# Altium project ASSIGNMENT_1.PrjPcb
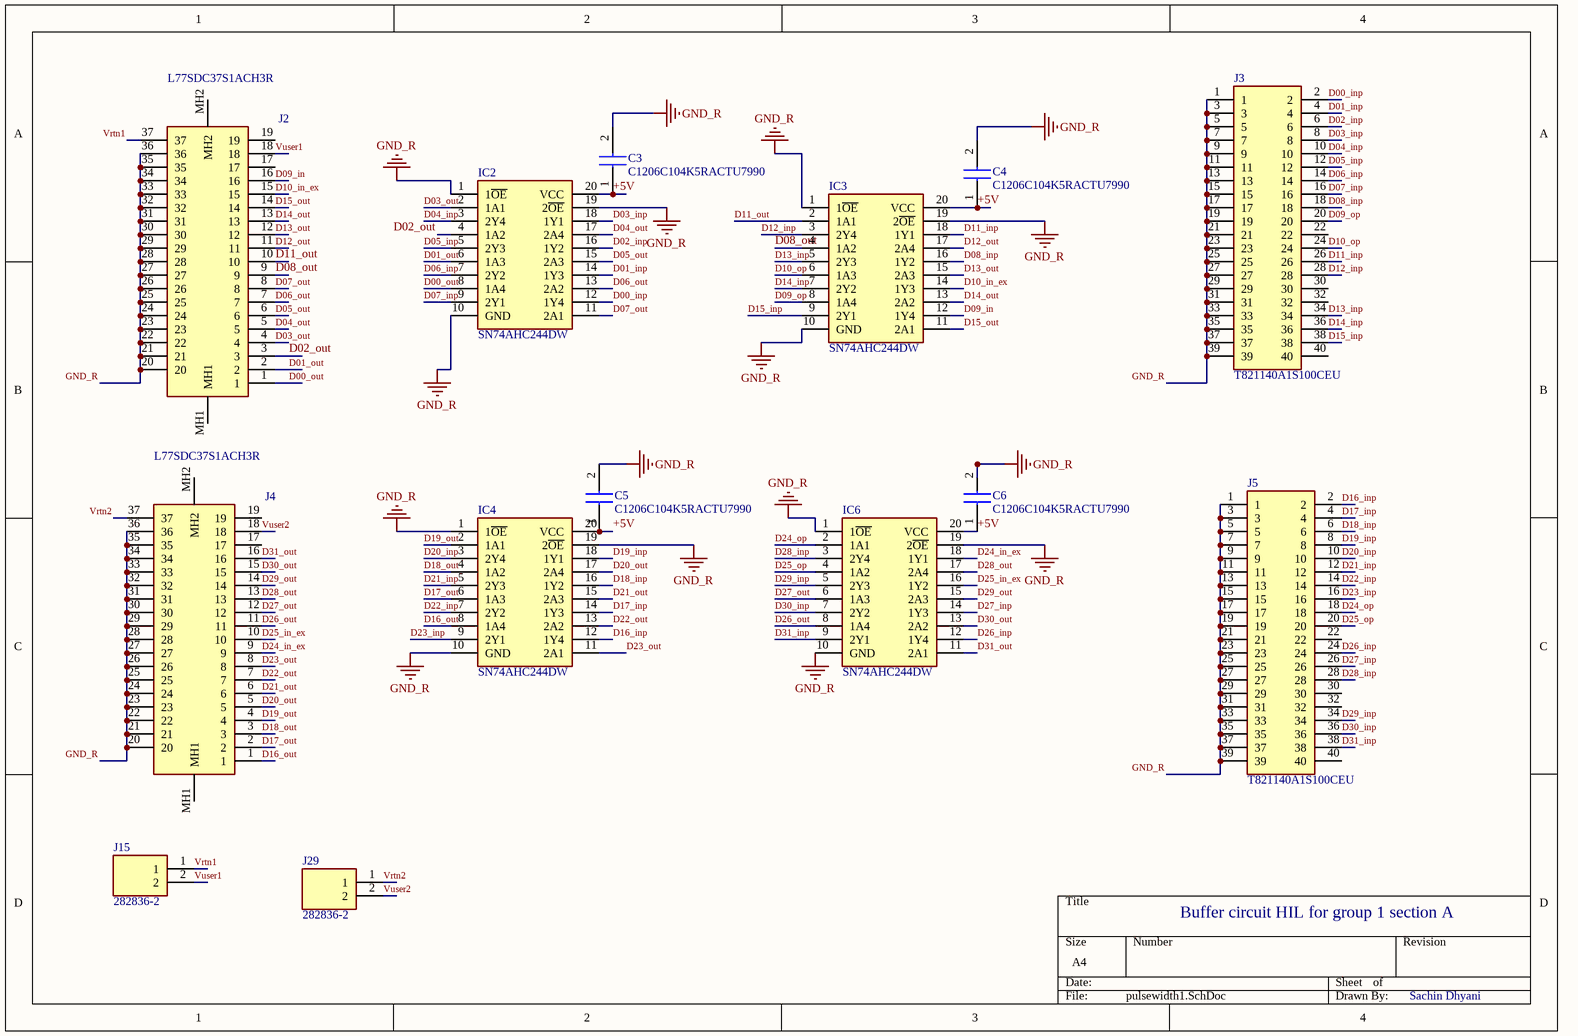
[diagram p0: pulsewidth1.SchDoc]
4 sheets, 53 parts. Net scope: global (net labels, ports and power ports of the same name join across sheets).
Board file: finalpcb.PcbDoc
Sheets:
  pulsewidth1.SchDoc
  pulsewidth2.SchDoc
  power_supply.SchDoc
  Analog_1_16.SchDoc

## Sheet pulsewidth1.SchDoc
size A4; SheetNumber: 1; SheetTotal: 4

### Parts
C3  C1206C104K5RACTU7990  [CAPC3216X88N]
C4  C1206C104K5RACTU7990  [CAPC3216X88N]
C5  C1206C104K5RACTU7990  [CAPC3216X88N]
C6  C1206C104K5RACTU7990  [CAPC3216X88N]
IC2  SN74AHC244DW  [SOIC127P1030X265-20N]
IC3  SN74AHC244DW  [SOIC127P1030X265-20N]
IC4  SN74AHC244DW  [SOIC127P1030X265-20N]
IC6  SN74AHC244DW  [SOIC127P1030X265-20N]
J2  L77SDC37S1ACH3R  [L77SDC37S1ACH3R]
J3  T821140A1S100CEU  [SHDR40W64P254X254_2X20_5842X895X915P]
J4  L77SDC37S1ACH3R  [L77SDC37S1ACH3R]
J5  T821140A1S100CEU  [SHDR40W64P254X254_2X20_5842X895X915P]
J15  282836-2  [2828362]
J29  282836-2  [2828362]

### Nets
GND_R: C3.2 C4.2 C5.2 C6.2 IC2.1(1~{OE}) IC2.10(GND) IC2.19(2~{OE}) IC3.1(1~{OE}) IC3.10(GND) IC3.19(2~{OE}) IC4.1(1~{OE}) IC4.10(GND) IC4.19(2~{OE}) IC6.1(1~{OE}) IC6.10(GND) IC6.19(2~{OE}) J2.20 J2.21 J2.22 J2.23 J2.24 J2.25 J2.26 J2.27 J2.28 J2.29 J2.30 J2.31 J2.32 J2.33 J2.34 J2.35 J2.36 J3.1 J3.3 J3.5 J3.7 J3.9 J3.11 J3.13 J3.15 J3.17 J3.19 J3.21 J3.23 J3.25 J3.27 J3.29 J3.31 J3.33 J3.35 J3.37 J3.39 J4.20 J4.21 J4.22 J4.23 J4.24 J4.25 J4.26 J4.27 J4.28 J4.29 J4.30 J4.31 J4.32 J4.33 J4.34 J4.35 J4.36 J5.1 J5.3 J5.5 J5.7 J5.9 J5.11 J5.13 J5.15 J5.17 J5.19 J5.21 J5.23 J5.25 J5.27 J5.29 J5.31 J5.33 J5.35 J5.37 J5.39
+5V: C3.1 C4.1 C5.1 C6.1 IC2.20(VCC) IC3.20(VCC) IC4.20(VCC) IC6.20(VCC)
D00_inp: IC2.12(1Y4) J3.2
D00_out: IC2.8(1A4) J2.1
D01_inp: IC2.14(1Y3) J3.4
D01_out: IC2.6(1A3) J2.2
D02_inp: IC2.16(1Y2) J3.6
D02_out: IC2.4(1A2) J2.3
D03_inp: IC2.18(1Y1) J3.8
D03_out: IC2.2(1A1) J2.4
D04_inp: IC2.3(2Y4) J3.10
D04_out: IC2.17(2A4) J2.5
D05_inp: IC2.5(2Y3) J3.12
D05_out: IC2.15(2A3) J2.6
D06_inp: IC2.7(2Y2) J3.14
D06_out: IC2.13(2A2) J2.7
D07_inp: IC2.9(2Y1) J3.16
D07_out: IC2.11(2A1) J2.8
D08_inp: IC3.16(1Y2) J3.18
D08_out: IC3.4(1A2) J2.9
D09_in: IC3.12(1Y4) J2.16
D09_op: IC3.8(1A4) J3.20
D10_in_ex: IC3.14(1Y3) J2.15
D10_op: IC3.6(1A3) J3.24
D11_inp: IC3.18(1Y1) J3.26
D11_out: IC3.2(1A1) J2.10
D12_inp: IC3.3(2Y4) J3.28
D12_out: IC3.17(2A4) J2.11
D13_inp: IC3.5(2Y3) J3.34
D13_out: IC3.15(2A3) J2.12
D14_inp: IC3.7(2Y2) J3.36
D14_out: IC3.13(2A2) J2.13
D15_inp: IC3.9(2Y1) J3.38
D15_out: IC3.11(2A1) J2.14
D16_inp: IC4.12(1Y4) J5.2
D16_out: IC4.8(1A4) J4.1
D17_inp: IC4.14(1Y3) J5.4
D17_out: IC4.6(1A3) J4.2
D18_inp: IC4.16(1Y2) J5.6
D18_out: IC4.4(1A2) J4.3
D19_inp: IC4.18(1Y1) J5.8
D19_out: IC4.2(1A1) J4.4
D20_inp: IC4.3(2Y4) J5.10
D20_out: IC4.17(2A4) J4.5
D21_inp: IC4.5(2Y3) J5.12
D21_out: IC4.15(2A3) J4.6
D22_inp: IC4.7(2Y2) J5.14
D22_out: IC4.13(2A2) J4.7
D23_inp: IC4.9(2Y1) J5.16
D23_out: IC4.11(2A1) J4.8
D24_in_ex: IC6.18(1Y1) J4.9
D24_op: IC6.2(1A1) J5.18
D25_in_ex: IC6.16(1Y2) J4.10
D25_op: IC6.4(1A2) J5.20
D26_inp: IC6.12(1Y4) J5.24
D26_out: IC6.8(1A4) J4.11
D27_inp: IC6.14(1Y3) J5.26
D27_out: IC6.6(1A3) J4.12
D28_inp: IC6.3(2Y4) J5.28
D28_out: IC6.17(2A4) J4.13
D29_inp: IC6.5(2Y3) J5.34
D29_out: IC6.15(2A3) J4.14
D30_inp: IC6.7(2Y2) J5.36
D30_out: IC6.13(2A2) J4.15
D31_inp: IC6.9(2Y1) J5.38
D31_out: IC6.11(2A1) J4.16
Vrtn1: J2.37 J15.1
Vrtn2: J4.37 J29.1
Vuser1: J2.18 J15.2
Vuser2: J4.18 J29.2

Not connected (* = marked no-connect by the designer): J2 17 19 MH1 MH2; J3 22 30 32 40; J4 17 19 MH1 MH2; J5 22 30 32 40

### Notes on the sheet
- Buffer circuit HIL for group 1 section A
- Sachin Dhyani

### Library data of the parts
C3-C6 = C1206C104K5RACTU7990: Capacitor; Manufacturer_Name: KEMET; Datasheet Link: https://api.kemet.com/component-edge/download/specsheet/C1206C104K5RACTU.pdf; Height: 0.88mm; Manufacturer_Part_Number: C1206C104K5RACTU7990; Arrow Part Number: C1206C104K5RACTU7990; Arrow Price/Stock: https://www.arrow.com/en/products/c1206c104k5ractu7990/kemet-corporation?utm_currency=USD&region=nac
IC2-IC4 IC6 = SN74AHC244DW: Integrated Circuit; Manufacturer_Name: Texas Instruments; Datasheet Link: https://datasheet.datasheetarchive.com/originals/distributors/Datasheets-301/18405.pdf; Height: 2.65mm; Manufacturer_Part_Number: SN74AHC244DW; Mouser Part Number: 595-SN74AHC244DW; Mouser Price/Stock: https://www.mouser.co.uk/ProductDetail/Texas-Instruments/SN74AHC244DW?qs=j%2FZo4ajzVJKtLyxm%252BX3lew%3D%3D; Arrow Part Number: SN74AHC244DW; Arrow Price/Stock: https://www.arrow.com/en/products/sn74ahc244dw/texas-instruments?region=nac
J2 J4 = L77SDC37S1ACH3R: Connector; Manufacturer_Name: Amphenol; Datasheet Link: https://cdn.amphenol-cs.com/media/wysiwyg/files/drawing/l77sdxxxs1ach3r.pdf; Height: 12.93mm; Manufacturer_Part_Number: L77SDC37S1ACH3R; Mouser Part Number: 523-L77SDC37S1ACH3R; Mouser Price/Stock: https://www.mouser.co.uk/ProductDetail/Amphenol-Commercial-Products/L77SDC37S1ACH3R?qs=mq7kV%2Fq8lk7HpO2gUh7qRA%3D%3D
J3 J5 = T821140A1S100CEU: Connector; Manufacturer_Name: Amphenol; Datasheet Link: http://www.farnell.com/datasheets/1648843.pdf; Height: 9.15mm; Manufacturer_Part_Number: T821140A1S100CEU; Mouser Part Number: N/A; Mouser Price/Stock: https://www.mouser.co.uk/ProductDetail/Amphenol/T821140A1S100CEU?qs=%252BRAvXJslkuDIVA7vEt1SFA%3D%3D; Arrow Part Number: T821140A1S100CEU; Arrow Price/Stock: https://www.arrow.com/en/products/t821140a1s100ceu/amphenol-fci?region=europe
J15 J29 = 282836-2: Connector; Manufacturer_Name: TE Connectivity; Datasheet Link: https://www.te.com/commerce/DocumentDelivery/DDEController?Action=srchrtrv&DocNm=1-1773458-1_EURO_STYLE_QRG&DocType=Data%20Sheet&DocLang=English&PartCntxt=282836-2&DocFormat=pdf; Height: 10mm; Manufacturer_Part_Number: 282836-2; Mouser Part Number: 571-2828362; Mouser Price/Stock: https://www.mouser.co.uk/ProductDetail/TE-Connectivity/282836-2?qs=A%252Bip%252BNCYi6Ohx9vaQ1l4dg%3D%3D; Arrow Part Number: 282836-2; Arrow Price/Stock: https://www.arrow.com/en/products/282836-2/te-connectivity?utm_currency=USD&region=nac

## Sheet pulsewidth2.SchDoc
size A4; SheetNumber: 2; SheetTotal: 4
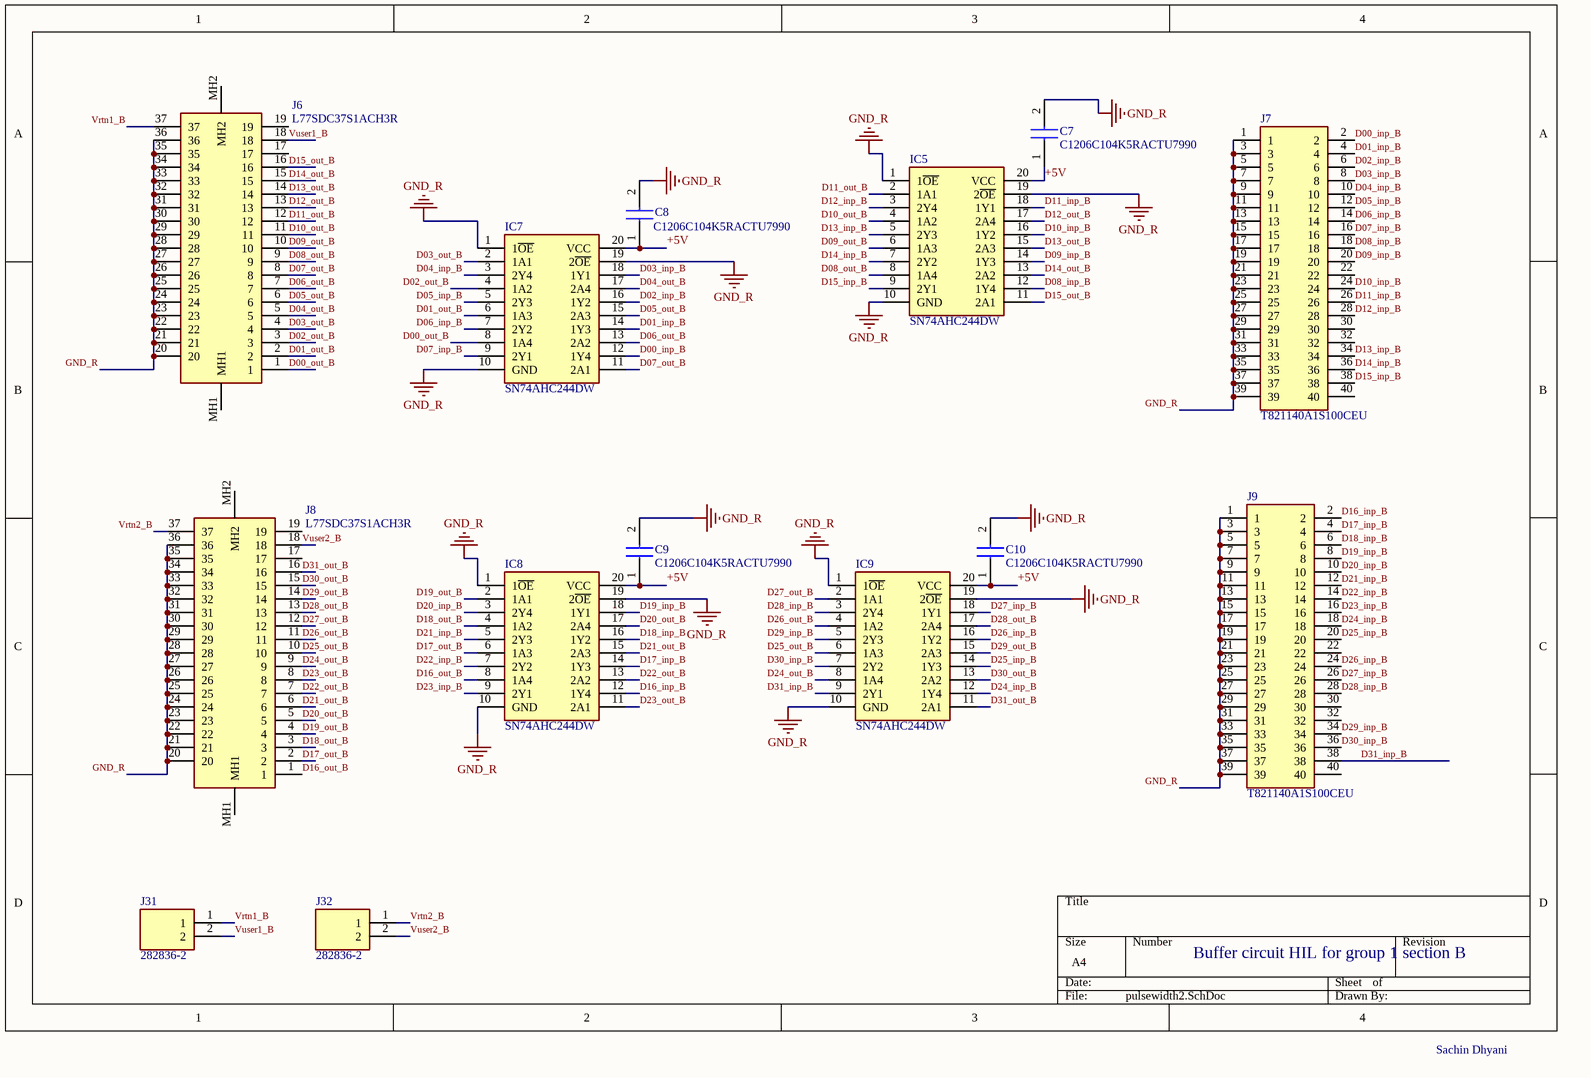
[diagram p1: pulsewidth2.SchDoc]

### Parts
C7  C1206C104K5RACTU7990  [CAPC3216X88N]
C8  C1206C104K5RACTU7990  [CAPC3216X88N]
C9  C1206C104K5RACTU7990  [CAPC3216X88N]
C10  C1206C104K5RACTU7990  [CAPC3216X88N]
IC5  SN74AHC244DW  [SOIC127P1030X265-20N]
IC7  SN74AHC244DW  [SOIC127P1030X265-20N]
IC8  SN74AHC244DW  [SOIC127P1030X265-20N]
IC9  SN74AHC244DW  [SOIC127P1030X265-20N]
J6  L77SDC37S1ACH3R  [L77SDC37S1ACH3R]
J7  T821140A1S100CEU  [SHDR40W64P254X254_2X20_5842X895X915P]
J8  L77SDC37S1ACH3R  [L77SDC37S1ACH3R]
J9  T821140A1S100CEU  [SHDR40W64P254X254_2X20_5842X895X915P]
J31  282836-2  [2828362]
J32  282836-2  [2828362]

### Nets
GND_R: C7.2 C8.2 C9.2 C10.2 IC5.1(1~{OE}) IC5.10(GND) IC5.19(2~{OE}) IC7.1(1~{OE}) IC7.10(GND) IC7.19(2~{OE}) IC8.1(1~{OE}) IC8.10(GND) IC8.19(2~{OE}) IC9.1(1~{OE}) IC9.10(GND) IC9.19(2~{OE}) J6.20 J6.21 J6.22 J6.23 J6.24 J6.25 J6.26 J6.27 J6.28 J6.29 J6.30 J6.31 J6.32 J6.33 J6.34 J6.35 J6.36 J7.1 J7.3 J7.5 J7.7 J7.9 J7.11 J7.13 J7.15 J7.17 J7.19 J7.21 J7.23 J7.25 J7.27 J7.29 J7.31 J7.33 J7.35 J7.37 J7.39 J8.20 J8.21 J8.22 J8.23 J8.24 J8.25 J8.26 J8.27 J8.28 J8.29 J8.30 J8.31 J8.32 J8.33 J8.34 J8.35 J8.36 J9.1 J9.3 J9.5 J9.7 J9.9 J9.11 J9.13 J9.15 J9.17 J9.19 J9.21 J9.23 J9.25 J9.27 J9.29 J9.31 J9.33 J9.35 J9.37 J9.39
+5V: C7.1 C8.1 C9.1 C10.1 IC5.20(VCC) IC7.20(VCC) IC8.20(VCC) IC9.20(VCC)
D00_inp_B: IC7.12(1Y4) J7.2
D00_out_B: IC7.8(1A4) J6.1
D01_inp_B: IC7.14(1Y3) J7.4
D01_out_B: IC7.6(1A3) J6.2
D02_inp_B: IC7.16(1Y2) J7.6
D02_out_B: IC7.4(1A2) J6.3
D03_inp_B: IC7.18(1Y1) J7.8
D03_out_B: IC7.2(1A1) J6.4
D04_inp_B: IC7.3(2Y4) J7.10
D04_out_B: IC7.17(2A4) J6.5
D05_inp_B: IC7.5(2Y3) J7.12
D05_out_B: IC7.15(2A3) J6.6
D06_inp_B: IC7.7(2Y2) J7.14
D06_out_B: IC7.13(2A2) J6.7
D07_inp_B: IC7.9(2Y1) J7.16
D07_out_B: IC7.11(2A1) J6.8
D08_inp_B: IC5.12(1Y4) J7.18
D08_out_B: IC5.8(1A4) J6.9
D09_inp_B: IC5.14(1Y3) J7.20
D09_out_B: IC5.6(1A3) J6.10
D10_inp_B: IC5.16(1Y2) J7.24
D10_out_B: IC5.4(1A2) J6.11
D11_inp_B: IC5.18(1Y1) J7.26
D11_out_B: IC5.2(1A1) J6.12
D12_inp_B: IC5.3(2Y4) J7.28
D12_out_B: IC5.17(2A4) J6.13
D13_inp_B: IC5.5(2Y3) J7.34
D13_out_B: IC5.15(2A3) J6.14
D14_inp_B: IC5.7(2Y2) J7.36
D14_out_B: IC5.13(2A2) J6.15
D15_inp_B: IC5.9(2Y1) J7.38
D15_out_B: IC5.11(2A1) J6.16
D16_inp_B: IC8.12(1Y4) J9.2
D16_out_B: IC8.8(1A4) J8.1
D17_inp_B: IC8.14(1Y3) J9.4
D17_out_B: IC8.6(1A3) J8.2
D18_inp_B: IC8.16(1Y2) J9.6
D18_out_B: IC8.4(1A2) J8.3
D19_inp_B: IC8.18(1Y1) J9.8
D19_out_B: IC8.2(1A1) J8.4
D20_inp_B: IC8.3(2Y4) J9.10
D20_out_B: IC8.17(2A4) J8.5
D21_inp_B: IC8.5(2Y3) J9.12
D21_out_B: IC8.15(2A3) J8.6
D22_inp_B: IC8.7(2Y2) J9.14
D22_out_B: IC8.13(2A2) J8.7
D23_inp_B: IC8.9(2Y1) J9.16
D23_out_B: IC8.11(2A1) J8.8
D24_inp_B: IC9.12(1Y4) J9.18
D24_out_B: IC9.8(1A4) J8.9
D25_inp_B: IC9.14(1Y3) J9.20
D25_out_B: IC9.6(1A3) J8.10
D26_inp_B: IC9.16(1Y2) J9.24
D26_out_B: IC9.4(1A2) J8.11
D27_inp_B: IC9.18(1Y1) J9.26
D27_out_B: IC9.2(1A1) J8.12
D28_inp_B: IC9.3(2Y4) J9.28
D28_out_B: IC9.17(2A4) J8.13
D29_inp_B: IC9.5(2Y3) J9.34
D29_out_B: IC9.15(2A3) J8.14
D30_inp_B: IC9.7(2Y2) J9.36
D30_out_B: IC9.13(2A2) J8.15
D31_inp_B: IC9.9(2Y1) J9.38
D31_out_B: IC9.11(2A1) J8.16
Vrtn1_B: J6.37 J31.1
Vrtn2_B: J8.37 J32.1
Vuser1_B: J6.18 J31.2
Vuser2_B: J8.18 J32.2

Not connected (* = marked no-connect by the designer): J6 17 19 MH1 MH2; J7 22 30 32 40; J8 17 19 MH1 MH2; J9 22 30 32 40

### Notes on the sheet
- Buffer circuit HIL for group 1 section B
- Sachin Dhyani

### Library data of the parts
C7-C10 = C1206C104K5RACTU7990: Capacitor; Manufacturer_Name: KEMET; Datasheet Link: https://api.kemet.com/component-edge/download/specsheet/C1206C104K5RACTU.pdf; Height: 0.88mm; Manufacturer_Part_Number: C1206C104K5RACTU7990; Arrow Part Number: C1206C104K5RACTU7990; Arrow Price/Stock: https://www.arrow.com/en/products/c1206c104k5ractu7990/kemet-corporation?utm_currency=USD&region=nac
IC5 IC7-IC9 = SN74AHC244DW: as IC2 on sheet pulsewidth1; Datasheet Link: https://datasheet.datasheetarchive.com/originals/distributors/Datasheets-301/18405.pdf; Height: 2.65mm; Manufacturer_Part_Number: SN74AHC244DW; Mouser Part Number: 595-SN74AHC244DW; Mouser Price/Stock: https://www.mouser.co.uk/ProductDetail/Texas-Instruments/SN74AHC244DW?qs=j%2FZo4ajzVJKtLyxm%252BX3lew%3D%3D; Arrow Part Number: SN74AHC244DW; Arrow Price/Stock: https://www.arrow.com/en/products/sn74ahc244dw/texas-instruments?region=nac
J6 J8 = L77SDC37S1ACH3R: Connector; Manufacturer_Name: Amphenol; Datasheet Link: https://cdn.amphenol-cs.com/media/wysiwyg/files/drawing/l77sdxxxs1ach3r.pdf; Height: 12.93mm; Manufacturer_Part_Number: L77SDC37S1ACH3R; Mouser Part Number: 523-L77SDC37S1ACH3R; Mouser Price/Stock: https://www.mouser.co.uk/ProductDetail/Amphenol-Commercial-Products/L77SDC37S1ACH3R?qs=mq7kV%2Fq8lk7HpO2gUh7qRA%3D%3D
J7 J9 = T821140A1S100CEU: Connector; Manufacturer_Name: Amphenol; Datasheet Link: http://www.farnell.com/datasheets/1648843.pdf; Height: 9.15mm; Manufacturer_Part_Number: T821140A1S100CEU; Mouser Part Number: N/A; Mouser Price/Stock: https://www.mouser.co.uk/ProductDetail/Amphenol/T821140A1S100CEU?qs=%252BRAvXJslkuDIVA7vEt1SFA%3D%3D; Arrow Part Number: T821140A1S100CEU; Arrow Price/Stock: https://www.arrow.com/en/products/t821140a1s100ceu/amphenol-fci?region=europe
J31 J32 = 282836-2: as J15 on sheet pulsewidth1; Datasheet Link: https://www.te.com/commerce/DocumentDelivery/DDEController?Action=srchrtrv&DocNm=1-1773458-1_EURO_STYLE_QRG&DocType=Data%20Sheet&DocLang=English&PartCntxt=282836-2&DocFormat=pdf; Height: 10mm; Manufacturer_Part_Number: 282836-2; Mouser Part Number: 571-2828362; Mouser Price/Stock: https://www.mouser.co.uk/ProductDetail/TE-Connectivity/282836-2?qs=A%252Bip%252BNCYi6Ohx9vaQ1l4dg%3D%3D; Arrow Part Number: 282836-2; Arrow Price/Stock: https://www.arrow.com/en/products/282836-2/te-connectivity?utm_currency=USD&region=nac

## Sheet power_supply.SchDoc
size A4; SheetNumber: 3; SheetTotal: 4
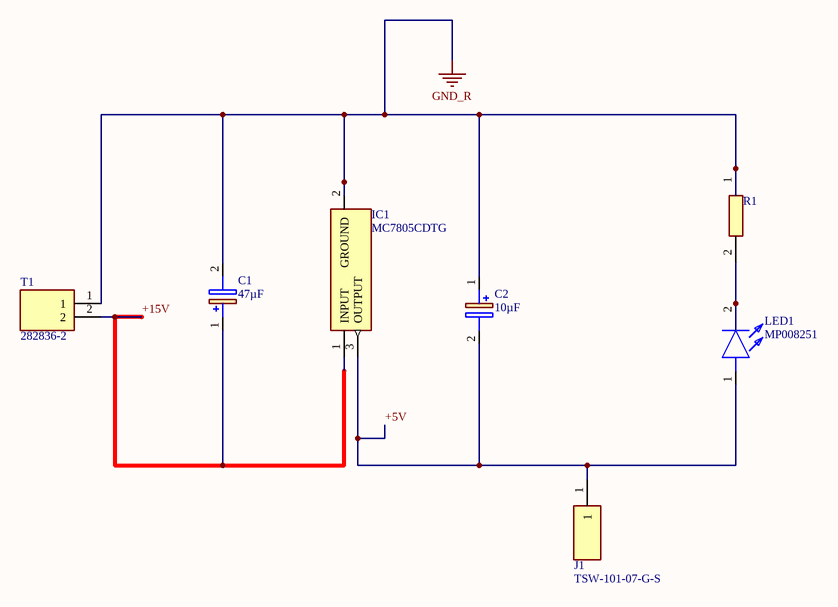
[diagram p2: power_supply.SchDoc]

### Parts
C1  value 47µF  [CAPAE1030X1050N]  (hidden comment: UUX2A470MNL1GS)
C2  value 10µF  [CAPPM6032X280N]  (hidden comment: TPSC106K025R0500)
IC1  MC7805CDTG  [MC7915ACD2TG]
J1  TSW-101-07-G-S  [TSW-101-XX-YY-S]
LED1  MP008251  [SM0603SRC]
R1  CRCW2010100KFKEF  [RESC5025X71N]  (value not drawn)
T1  282836-2  [2828362]

### Nets
GND_R: C1.2(-) C2.1(+) IC1.2(GROUND) R1.1 T1.1
+5V: C2.2(-) IC1.3(OUTPUT) J1.1 LED1.1(A)
+15V: C1.1(+) IC1.1(INPUT) T1.2
NetLED1_2: LED1.2(K) R1.2

### Library data of the parts
C1 = CMP-001-00092-1: Capacitor, Radial / Can - SMD, 47 µF, / 100 V, 2000 hours / @ 105°C, Polar Surface Mount / Tantalum; Manufacturer_Name: Nichicon; Component Type: Standard; Manufacturer_Part_Number: UUX2A470MNL1GS; Arrow Part Number: UUX2A470MNL1GS; Design Item ID: UUX2A470MNL1GS; Height: 10.5mm; Pins: 2; Arrow Price/Stock: https://www.arrow.com/en/products/uux2a470mnl1gs/nichicon; Mouser Part Number: 647-UUX2A470MNL1GS; Mouser Price/Stock: https://www.mouser.co.uk/ProductDetail/Nichicon/UUX2A470MNL1GS?qs=jZZh9D7uMhmPZMofMKn2Fg%3D%3D; Source: Schlib1.SchLib; Datasheet Link: https://componentsearchengine.com/Datasheets/1/UUX2A470MNL1GS.pdf
C2 = CMP-001-00091-1: Capacitor, 10 µF, / 25 V, 2312 [6032 / Metric], ± 10%, 0.5 / ohm, C; Manufacturer_Name: AVX; Pins: 2; Datasheet Link: https://componentsearchengine.com/Datasheets/2/TPSC106K025R0500.pdf; Manufacturer_Part_Number: TPSC106K025R0500; Component Type: Standard; Arrow Part Number: TPSC106K025R0500; Mouser Price/Stock: https://www.mouser.co.uk/ProductDetail/AVX/TPSC106K025R0500?qs=xw8XwkEH2YWjgnPlag1OVw%3D%3D; Design Item ID: TPSC106K025R0500; Arrow Price/Stock: https://www.arrow.com/en/products/tpsc106k025r0500/avx?region=nac; Height: 2.8mm; Source: Schlib1.SchLib; Mouser Part Number: 581-TPSC106K025R0500
IC1 = CMP-031-00039-1: Integrated Circuit; Manufacturer_Name: onsemi; Mouser Part Number: 863-MC7805CDTG; Arrow Price/Stock: https://www.arrow.com/en/products/mc7805cdtg/on-semiconductor?region=europe; Datasheet Link: https://www.onsemi.com/pdf/datasheet/mc7800-d.pdf; Source: RIL_SCH.SchLib; Arrow Part Number: MC7805CDTG; Mouser Price/Stock: https://www.mouser.co.uk/ProductDetail/onsemi/MC7805CDTG?qs=%252B9%2Fcbd0IE0RdeBGvK4GFRg%3D%3D; Manufacturer_Part_Number: MC7805CDTG; Height: 2.51mm; Design Item ID: MC7805CDTG
J1 = CMP-002-00078-1: Connector; Manufacturer_Name: SAMTEC; Arrow Part Number: TSW-101-07-G-S; Arrow Price/Stock: https://www.arrow.com/en/products/tsw-101-07-g-s/samtec?region=europe; Datasheet Link: http://suddendocs.samtec.com/prints/tsw-xxx-xx-xxx-x-xx-xxx-mkt.pdf; Component Type: Standard; Pins: 1; Mouser Price/Stock: https://www.mouser.co.uk/ProductDetail/Samtec/TSW-101-07-G-S?qs=hzq9O0YpnZscfPe5oPvABA%3D%3D; Design Item ID: TSW-101-07-G-S; Manufacturer_Part_Number: TSW-101-07-G-S; Source: Schlib1.SchLib; Mouser Part Number: 200-TSW10107GS
LED1 = CMP-007-00046-1: LED; Pins: 2; Design Item ID: MP008251; Source: Schlib1.SchLib; Component Type: Standard
R1 = CMP-009-00182-1: Resistor; Manufacturer_Name: Vishay; Design Item ID: CRCW2010100KFKEF; Component Type: Standard; Manufacturer_Part_Number: CRCW2010100KFKEF; Mouser Part Number: 71-CRCW2010-100K-E3; Source: Schlib1.SchLib; Pins: 2; Mouser Price/Stock: https://www.mouser.co.uk/ProductDetail/Vishay-Dale/CRCW2010100KFKEF?qs=uSoEc56oFvqZsApDXVXFjw%3D%3D
T1 = CMP-012-00011-1: Connector; Manufacturer_Name: TE Connectivity; Manufacturer_Part_Number: 282836-2; Datasheet Link: https://www.te.com/commerce/DocumentDelivery/DDEController?Action=showdoc&DocId=Customer+Drawing%7F282836%7FJ%7Fpdf%7FEnglish%7FENG_CD_282836_J.pdf%7F282836-2; Source: Schlib1.SchLib; Component Type: Standard; Pins: 2; Height: 10mm; Arrow Part Number: 282836-2; Arrow Price/Stock: https://www.arrow.com/en/products/282836-2/te-connectivity?region=europe; Mouser Part Number: 571-2828362; Design Item ID: 282836-2; Mouser Price/Stock: https://www.mouser.co.uk/ProductDetail/TE-Connectivity/282836-2?qs=A%252Bip%252BNCYi6Ohx9vaQ1l4dg%3D%3D

## Sheet Analog_1_16.SchDoc
size A4; SheetNumber: 4; SheetTotal: 4
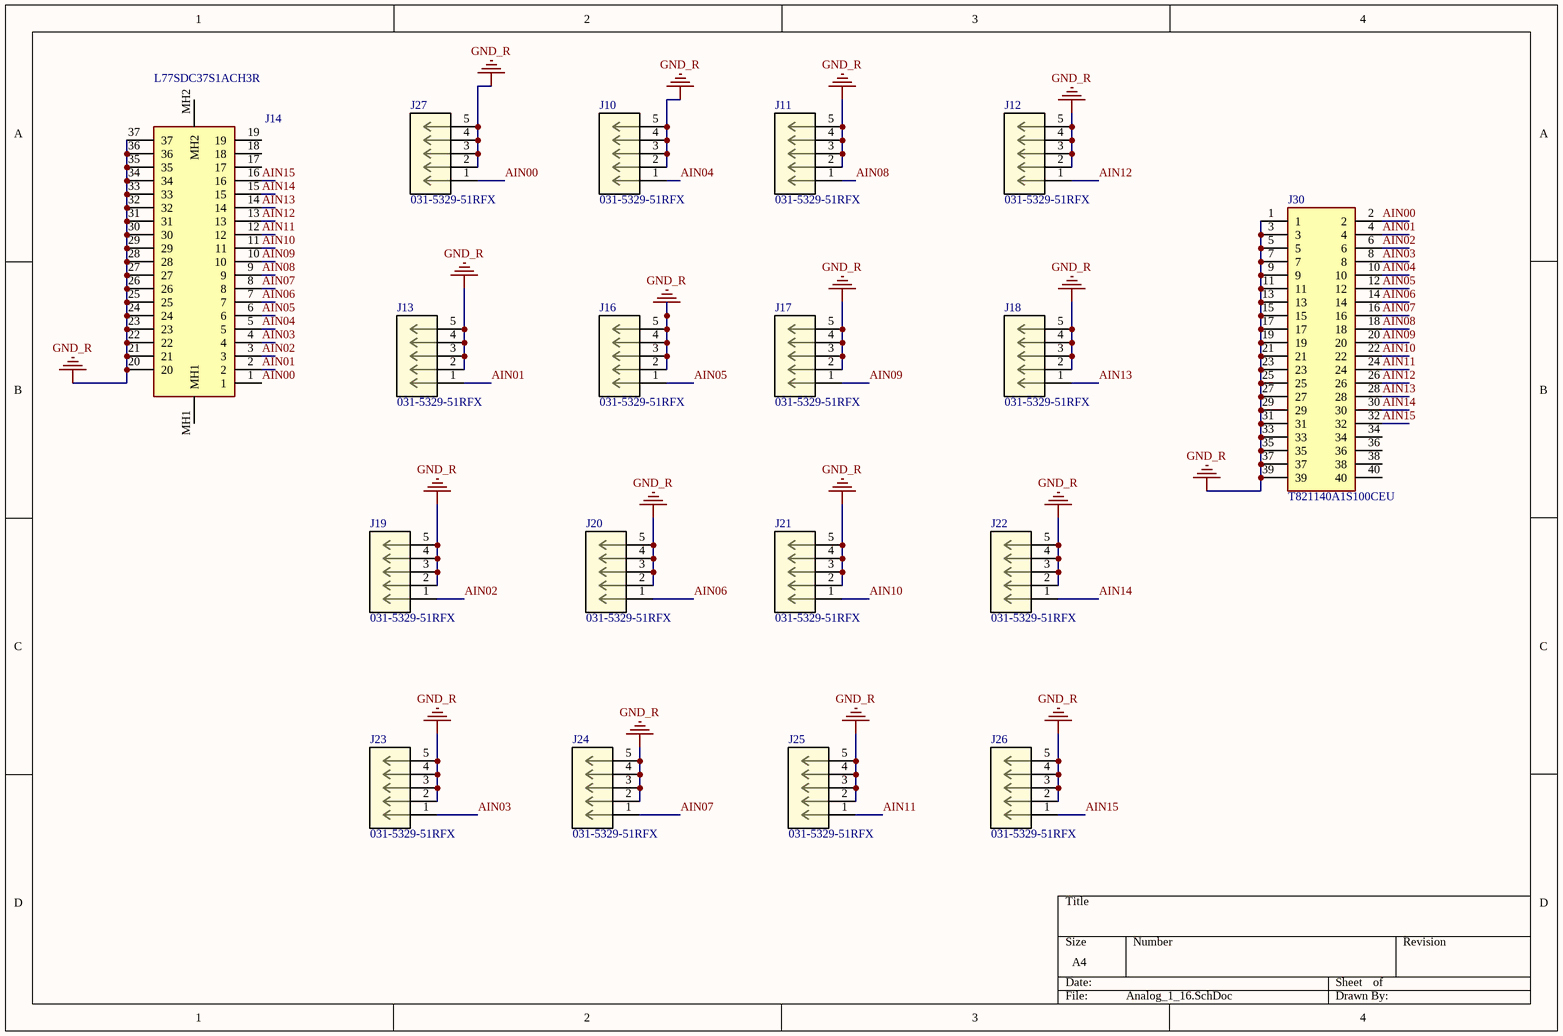
[diagram p3: Analog_1_16.SchDoc]

### Parts
J10  031-5329-51RFX  [CONN1_031-5329-51RFX_AMP]
J11  031-5329-51RFX  [CONN1_031-5329-51RFX_AMP]
J12  031-5329-51RFX  [CONN1_031-5329-51RFX_AMP]
J13  031-5329-51RFX  [CONN1_031-5329-51RFX_AMP]
J14  L77SDC37S1ACH3R  [L77SDC37S1ACH3R]
J16  031-5329-51RFX  [CONN1_031-5329-51RFX_AMP]
J17  031-5329-51RFX  [CONN1_031-5329-51RFX_AMP]
J18  031-5329-51RFX  [CONN1_031-5329-51RFX_AMP]
J19  031-5329-51RFX  [CONN1_031-5329-51RFX_AMP]
J20  031-5329-51RFX  [CONN1_031-5329-51RFX_AMP]
J21  031-5329-51RFX  [CONN1_031-5329-51RFX_AMP]
J22  031-5329-51RFX  [CONN1_031-5329-51RFX_AMP]
J23  031-5329-51RFX  [CONN1_031-5329-51RFX_AMP]
J24  031-5329-51RFX  [CONN1_031-5329-51RFX_AMP]
J25  031-5329-51RFX  [CONN1_031-5329-51RFX_AMP]
J26  031-5329-51RFX  [CONN1_031-5329-51RFX_AMP]
J27  031-5329-51RFX  [CONN1_031-5329-51RFX_AMP]
J30  T821140A1S100CEU  [SHDR40W64P254X254_2X20_5842X895X915P]

### Nets
GND_R: J10.2 J10.3 J10.4 J10.5 J11.2 J11.3 J11.4 J11.5 J12.2 J12.3 J12.4 J12.5 J13.2 J13.3 J13.4 J13.5 J14.20 J14.21 J14.22 J14.23 J14.24 J14.25 J14.26 J14.27 J14.28 J14.29 J14.30 J14.31 J14.32 J14.33 J14.34 J14.35 J14.36 J14.37 J16.2 J16.3 J16.4 J16.5 J17.2 J17.3 J17.4 J17.5 J18.2 J18.3 J18.4 J18.5 J19.2 J19.3 J19.4 J19.5 J20.2 J20.3 J20.4 J20.5 J21.2 J21.3 J21.4 J21.5 J22.2 J22.3 J22.4 J22.5 J23.2 J23.3 J23.4 J23.5 J24.2 J24.3 J24.4 J24.5 J25.2 J25.3 J25.4 J25.5 J26.2 J26.3 J26.4 J26.5 J27.2 J27.3 J27.4 J27.5 J30.1 J30.3 J30.5 J30.7 J30.9 J30.11 J30.13 J30.15 J30.17 J30.19 J30.21 J30.23 J30.25 J30.27 J30.29 J30.31 J30.33 J30.35 J30.37 J30.39
AIN00: J14.1 J27.1 J30.2
AIN01: J13.1 J14.2 J30.4
AIN02: J14.3 J19.1 J30.6
AIN03: J14.4 J23.1 J30.8
AIN04: J10.1 J14.5 J30.10
AIN05: J14.6 J16.1 J30.12
AIN06: J14.7 J20.1 J30.14
AIN07: J14.8 J24.1 J30.16
AIN08: J11.1 J14.9 J30.18
AIN09: J14.10 J17.1 J30.20
AIN10: J14.11 J21.1 J30.22
AIN11: J14.12 J25.1 J30.24
AIN12: J12.1 J14.13 J30.26
AIN13: J14.14 J18.1 J30.28
AIN14: J14.15 J22.1 J30.30
AIN15: J14.16 J26.1 J30.32

Not connected (* = marked no-connect by the designer): J14 17 18 19 MH1 MH2; J30 34 36 38 40

### Library data of the parts
J10-J13 J16-J27 = 031-5329-51RFX: No Description Available; Mfr_Name: Amphenol ICC; RefDes: RefDes; Type: Type
J14 = L77SDC37S1ACH3R: Connector; Manufacturer_Name: Amphenol; Datasheet Link: https://cdn.amphenol-cs.com/media/wysiwyg/files/drawing/l77sdxxxs1ach3r.pdf; Height: 12.93mm; Manufacturer_Part_Number: L77SDC37S1ACH3R; Mouser Part Number: 523-L77SDC37S1ACH3R; Mouser Price/Stock: https://www.mouser.co.uk/ProductDetail/Amphenol-Commercial-Products/L77SDC37S1ACH3R?qs=mq7kV%2Fq8lk7HpO2gUh7qRA%3D%3D
J30 = T821140A1S100CEU: Connector; Manufacturer_Name: Amphenol; Datasheet Link: http://www.farnell.com/datasheets/1648843.pdf; Height: 9.15mm; Manufacturer_Part_Number: T821140A1S100CEU; Mouser Part Number: N/A; Mouser Price/Stock: https://www.mouser.co.uk/ProductDetail/Amphenol/T821140A1S100CEU?qs=%252BRAvXJslkuDIVA7vEt1SFA%3D%3D; Arrow Part Number: T821140A1S100CEU; Arrow Price/Stock: https://www.arrow.com/en/products/t821140a1s100ceu/amphenol-fci?region=europe

## Nets that join several sheets
GND_R: pulsewidth1 (90 pins), pulsewidth2 (90 pins), power_supply (5 pins), Analog_1_16 (102 pins)
+5V: pulsewidth1 (8 pins), pulsewidth2 (8 pins), power_supply (C2.2 IC1.3 J1.1 LED1.1)